# Altium schematic sheet Master.SchDoc
size A4; SheetNumber: 1; SheetTotal: 6
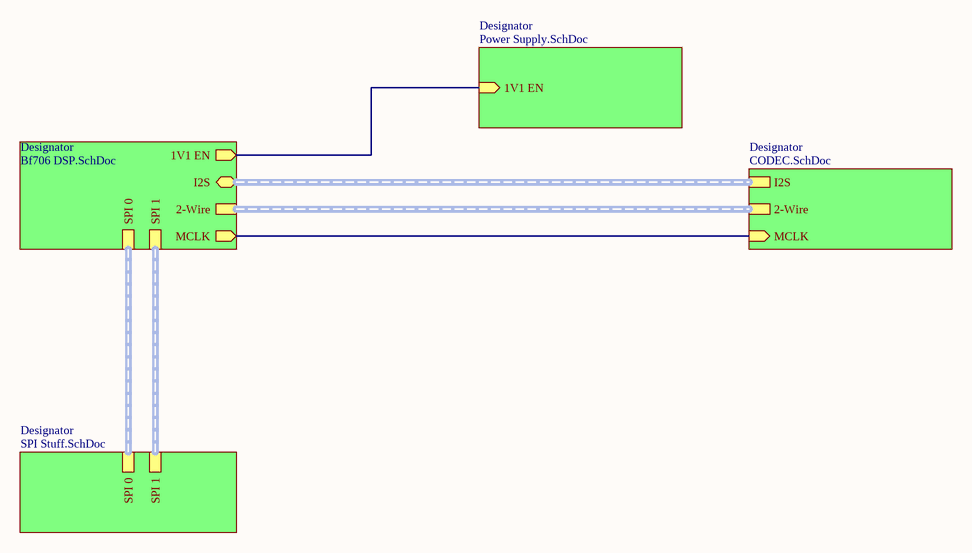
[diagram p0: Master.SchDoc]

## Sub-sheets
Designator = CODEC.SchDoc: I2S, 2-Wire, MCLK (in)
Designator = Power Supply.SchDoc: 1V1 EN (in)
Designator = Bf706 DSP.SchDoc: I2S (bidir), 2-Wire, SPI 0, SPI 1, MCLK (out), 1V1 EN (out)
Designator = SPI Stuff.SchDoc: SPI 0, SPI 1

## Nets
(unnamed): sheet Designator/MCLK, sheet Designator/MCLK
(unnamed): sheet Designator/1V1 EN, sheet Designator/1V1 EN